# EAGLE design pico (EAGLE 6.4)
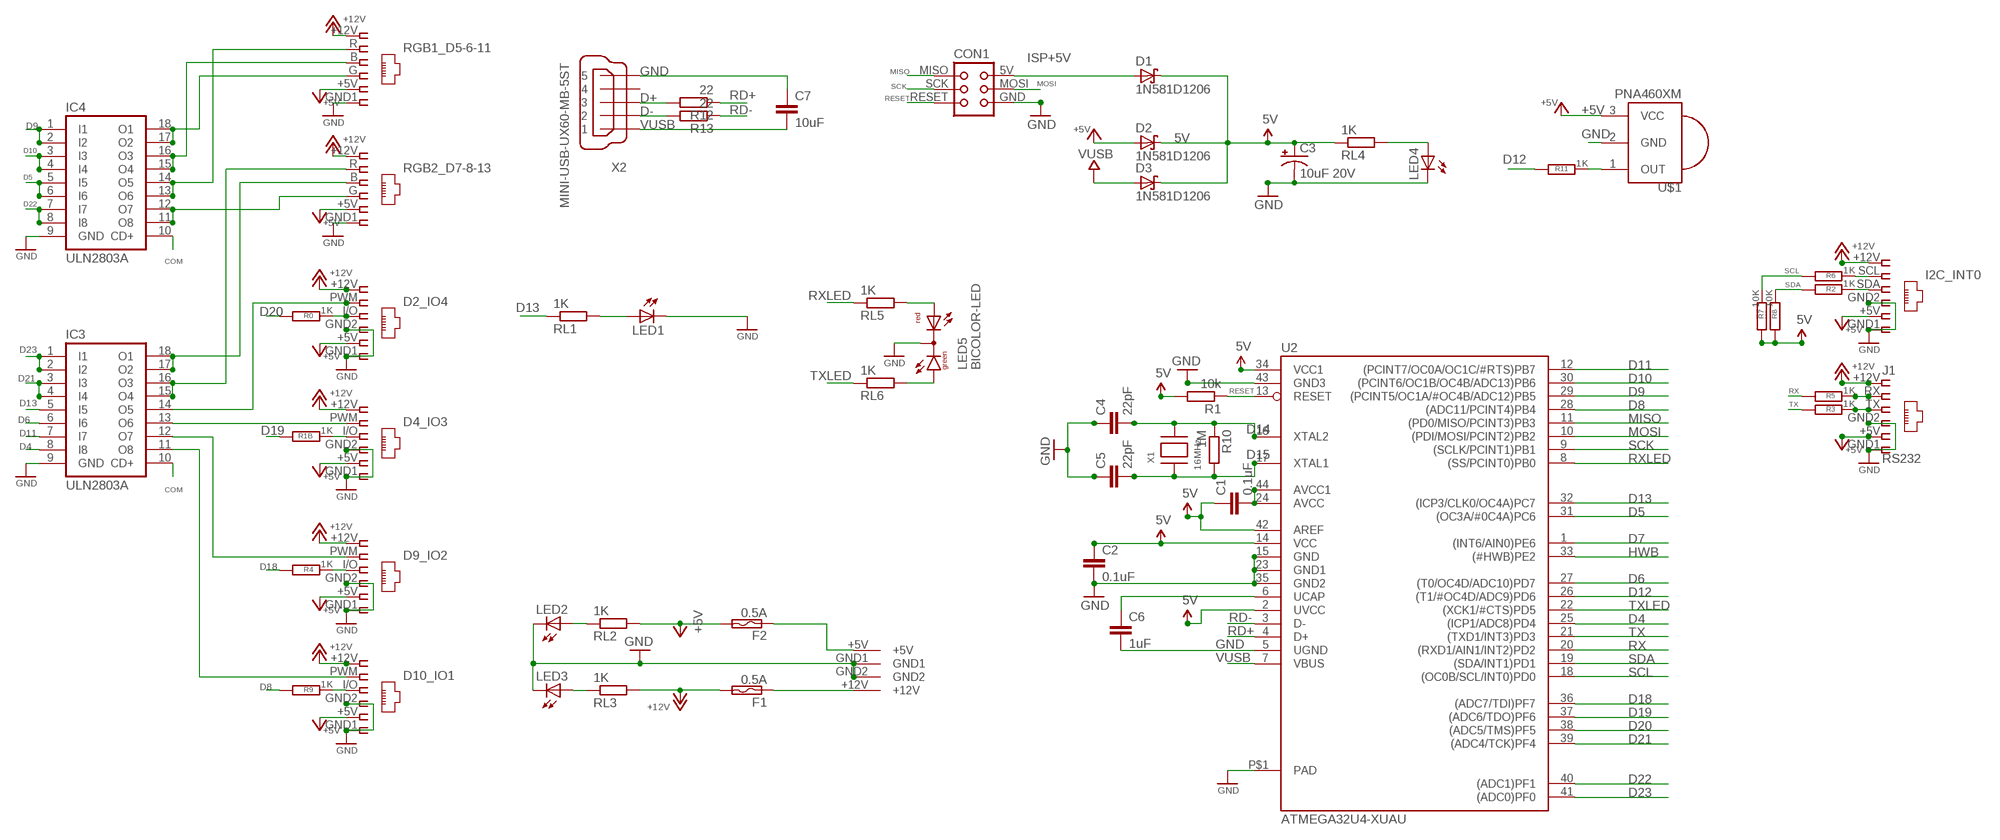
[diagram p0: schematic, sheet 1]

## Parts
C1  0.1uF  C-EUC1206  [C1206]
C2  0.1uF  C-EUC1206  [C1206]
C3  10uF 20V  CAP_POL1206-KIT  [EIA3216-KIT]
C4  22pF  C-EUC1206  [C1206]
C5  22pF  C-EUC1206  [C1206]
C6  1uF  C-EUC1206  [C1206]
C7  10uF  C-EUC1206  [C1206]
CON1  TINYISPT  [TC2030-MCP-NL]
D1  1N581D1206  [LED-1206]
D2  1N581D1206  [LED-1206]
D2_IO4  IO4  RJ12STRAIGHT  [RJ12-STRAIGHT]
D3  1N581D1206  [LED-1206]
D4_IO3  IO3  RJ12STRAIGHT  [RJ12-STRAIGHT]
D9_IO2  IO2  RJ12STRAIGHT  [RJ12-STRAIGHT]
D10_IO1  IO1  RJ12STRAIGHT  [RJ12-STRAIGHT]
F1  0.5A  POLYSWITCHSMD1812  [C1812]
F2  0.5A  POLYSWITCHSMD1812  [C1812]
I2C_INT0  I2C  RJ12STRAIGHT-I2C  [RJ12-STRAIGHT-I2C]
IC3  ULN2803A  [SO18W]
IC4  ULN2803A  [SO18W]
J1  RS232  RJ12STRAIGHT-RS232-SERVER  [RJ12-STRAIGHT-RS232]
LED1  LED3MM  [LED3MM]
LED2  5V  LED3MM  [LED3MM]
LED3  12V  LED3MM  [LED3MM]
LED4  5V uC  LED3MM  [LED3MM]
LED5  BICOLOR-LED  [BICOLOR-3MM]
R0  1K  R-EU_M1206  [M1206]
R1  10k  R-EU_M1206  [M1206]
R1B  1K  R-EU_M1206  [M1206]
R2  1K  R-EU_M1206  [M1206]
R3  1K  R-EU_M1206  [M1206]
R4  1K  R-EU_M1206  [M1206]
R5  1K  R-EU_M1206  [M1206]
R6  1K  R-EU_M1206  [M1206]
R7  10K  R-EU_M1206  [M1206]
R8  10K  R-EU_M1206  [M1206]
R9  1K  R-EU_M1206  [M1206]
R10  1M  R-EU_M1206  [M1206]
R11  1K  R-EU_M1206  [M1206]
R12  22  R-EU_M1206  [M1206]
R13  22  R-EU_M1206  [M1206]
RGB1_D5-6-11  RGB1  RJ12STRAIGHT-RGB  [RJ12-STRAIGHT-RGB]
RGB2_D7-8-13  RGB2  RJ12STRAIGHT-RGB  [RJ12-STRAIGHT-RGB]
RL1  1K  R-EU_M1206  [M1206]
RL2  1K  R-EU_M1206  [M1206]
RL3  1K  R-EU_M1206  [M1206]
RL4  1K  R-EU_M1206  [M1206]
RL5  1K  R-EU_M1206  [M1206]
RL6  1K  R-EU_M1206  [M1206]
U2  ATMEGA32U4-XUAU  [TQFP44-PAD]
U$1  PNA460XM  [PNA460XM]
U$2  KPJX-4S-S  [KPJX-4S-S]
X1  16MHz  XTALNX6035  [NX6035]
X2  MINI-USB-UX60-MB-5ST  [UX60-MB-5ST]

## Nets
5V: C1.1 C2.1 C3.A(+) D1.C D2.C D3.C R1.2 R7.2 R8.2 RL4.1 U2.2(UVCC) U2.14(VCC) U2.34(VCC1) U2.42(AREF)
+5V: D2.A D2_IO4.+5V D4_IO3.+5V D9_IO2.+5V D10_IO1.+5V F2.2 I2C_INT0.+5V J1.+5V RGB1_D5-6-11.+5V RGB2_D7-8-13.+5V RL2.2 U$1.3(VCC)
+12V: D2_IO4.+12V D4_IO3.+12V D9_IO2.+12V D10_IO1.+12V F1.2 I2C_INT0.+12V J1.+12V RGB1_D5-6-11.+12V RGB2_D7-8-13.+12V RL3.2
COM: IC3.10(CD+) IC4.10(CD+)
D2B: D9_IO2.I/O R4.1
D2B1: D10_IO1.I/O R9.1
D2B4: I2C_INT0.SDA R2.1
D2B5: J1.TX R3.1
D2B6: D2_IO4.I/O R0.1
D2B7: D4_IO3.I/O R1B.1
D4 [fine]: IC3.8(I8) U2.25((ICP1/ADC8)PD4)
D5 [fine]: IC4.5(I5) IC4.6(I6) U2.31((OC3A/#0C4A)PC6)
D6 [fine]: IC3.6(I6) U2.27((T0/OC4D/ADC10)PD7)
D7: U2.1((INT6/AIN0)PE6)
D8 [fine]: R9.2 U2.28((ADC11/PCINT4)PB4)
D9 [fine]: IC4.1(I1) IC4.2(I2) U2.29((PCINT5/OC1A/#OC4B/ADC12)PB5)
D10 [fine]: IC4.3(I3) IC4.4(I4) U2.30((PCINT6/OC1B/OC4B/ADC13)PB6)
D11 [fine]: IC3.7(I7) U2.12((PCINT7/OC0A/OC1C/#RTS)PB7)
D12: R11.2 U2.26((T1/#OC4D/ADC9)PD6)
D13 [fine]: IC3.5(I5) RL1.1 U2.32((ICP3/CLK0/OC4A)PC7)
D14 [fine]: C4.2 R10.1 U2.16(XTAL2) X1.P$2
D15 [fine]: C5.2 R10.2 U2.17(XTAL1) X1.P$1
D18 [fine]: R4.2 U2.36((ADC7/TDI)PF7)
D19 [fine]: R1B.2 U2.37((ADC6/TDO)PF6)
D20 [fine]: R0.2 U2.38((ADC5/TMS)PF5)
D21 [fine]: IC3.3(I3) IC3.4(I4) U2.39((ADC4/TCK)PF4)
D22 [fine]: IC4.7(I7) IC4.8(I8) U2.40((ADC1)PF1)
D23 [fine]: IC3.1(I1) IC3.2(I2) U2.41((ADC0)PF0)
D+: R12.2 X2.3
D-: R13.2 X2.2
GND: C2.2 C3.C(-) C4.1 C5.1 C6.2 C7.1 CON1.GND D2_IO4.GND1 D2_IO4.GND2 D4_IO3.GND1 D4_IO3.GND2 D9_IO2.GND1 D9_IO2.GND2 D10_IO1.GND1 D10_IO1.GND2 I2C_INT0.GND1 I2C_INT0.GND2 IC3.9(GND) IC4.9(GND) J1.GND1 J1.GND2 LED1.K(C) LED2.K(C) LED3.K(C) LED4.K(C) LED5.2(C) RGB1_D5-6-11.GND1 RGB2_D7-8-13.GND1 U2.5(UGND) U2.15(GND) U2.23(GND1) U2.35(GND2) U2.43(GND3) U2.P$1(PAD) U$1.2(GND) U$2.GND1 U$2.GND2 X2.5
HWB: U2.33((#HWB)PE2)
ISP+5V: CON1.5V(VCC) D1.A
MISO [fine]: CON1.MISO U2.11((PD0/MISO/PCINT3)PB3)
MOSI [fine]: CON1.MOSI U2.10((PDI/MOSI/PCINT2)PB2)
N$1 [PWM]: IC4.17(O2) IC4.18(O1) RGB1_D5-6-11.G
N$2 [PWM]: D4_IO3.PWM IC3.13(O6)
N$3: LED1.A RL1.2
N$4: C6.1 U2.6(UCAP)
N$6: F2.1 U$2.+5V
N$7: LED4.A RL4.2
N$8: F1.1 U$2.+12V
N$9: R11.1 U$1.1(OUT)
N$10: C1.2 U2.24(AVCC) U2.44(AVCC1)
N$11: LED5.3(AR) RL5.2
N$12: LED5.1(AG) RL6.2
N$13 [PWM]: IC3.15(O4) IC3.16(O3) RGB2_D7-8-13.R
N$22 [PWM]: D9_IO2.PWM IC3.12(O7)
N$48 [PWM]: IC3.17(O2) IC3.18(O1) RGB2_D7-8-13.B
N$50 [PWM]: IC4.15(O4) IC4.16(O3) RGB1_D5-6-11.B
N$51 [PWM]: D10_IO1.PWM IC3.11(O8)
N$57 [PWM]: IC4.11(O8) IC4.12(O7) RGB2_D7-8-13.G
N$60 [PWM]: D2_IO4.PWM IC3.14(O5)
N$68 [PWM]: IC4.13(O6) IC4.14(O5) RGB1_D5-6-11.R
N$70: J1.RX R5.1
N$71: I2C_INT0.SCL R6.1
N$75: LED3.A RL3.1
N$76: LED2.A RL2.1
RD+ [fine]: R12.1 U2.4(D+)
RD- [fine]: R13.1 U2.3(D-)
RESET [fine]: CON1.RESET R1.1 U2.13(RESET)
RX [fine]: R5.2 U2.20((RXD1/AIN1/INT2)PD2)
RXLED [fine]: RL5.1 U2.8((SS/PCINT0)PB0)
SCK [fine]: CON1.SCK U2.9((SCLK/PCINT1)PB1)
SCL [fine]: R6.2 R7.1 U2.18((OC0B/SCL/INT0)PD0)
SDA [fine]: R2.2 R8.1 U2.19((SDA/INT1)PD1)
TX [fine]: R3.2 U2.21((TXD1/INT3)PD3)
TXLED [fine]: RL6.1 U2.22((XCK1/#CTS)PD5)
VUSB: C7.2 D3.A U2.7(VBUS) X2.1
Unconnected: X2.4

## Library data of the parts
C1 C2 C4-C7 = resistor:C-EU: CAPACITOR, European symbol
C3 = SparkFun:CAP_POL: Capacitor Polarized These are standard SMD and PTH capacitors. Normally 10uF, 47uF, and 100uF in electrolytic and tantalum varieties. Always verify the external diameter of the through hole cap, it varies with capacity, voltage, and manufacturer. The EIA devices should be standard.
CON1 = lpatiny:TINYISP: CONNECTOR
D1-D3 = lpatiny:1N581*: 1.0A SCHOTTKY BARRIER RECTIFIER Source: http://www.diodes.com/datasheets/ds23001.pdf
D2_IO4 D4_IO3 D9_IO2 D10_IO1 I2C_INT0 J1 RGB1_D5-6-11 RGB2_D7-8-13 = lpatiny:RJ12: CORCOM Modular RJ Jacks No Shield Source: www.tycoelectronics.com .. ENG_DS_1654001_1099_RJ_L_0507.pdf
F1 F2 = lpatiny:POLYSWITCH: PolySwitch (TM) Resettable Device Source: Data sheet <http://www.farnell.com/datasheets/13482.pdf>
IC3 IC4 = lpatiny:ULN2803A: DRIVER ARRAY
LED1-LED4 = lpatiny:LED3MM
LED5 = lpatiny:BICOLOR-LED: T-1(3mm) BI-COLOR INDICATOR LAMP Source: Kingbright .. 2_colour_led_.pdf
R0 R1 R1B R2-R13 RL1-RL6 = resistor:R-EU_: RESISTOR, European symbol
U2 = SmartPrj:ATMEGA32U4-XU
U$1 = adafruit:PNA460XM: IR 38KHz receiver PNA4602 and related receivers http://www.ladyada.net/library/pcb/eaglelibrary.html
U$2 = lpatiny:KPJX-4S-S
X1 = lpatiny:XTAL: Low cost SMT crystals, no capacitors included http://www.ladyada.net/library/eagle
X2 = con-hirose:MINI-USB-: MINI USB Connector Source: http://www.hirose.co.jp/cataloge_hp/e24000019.pdf; OC_FARNELL: unknown; OC_NEWARK: unknown

## Net classes
0 default: width 0.457 mm
1 power: width 0.457 mm
2 highpower: width 0.914 mm
3 fine: width 0.457 mm
4 PWM: width 0.61 mm

## Board
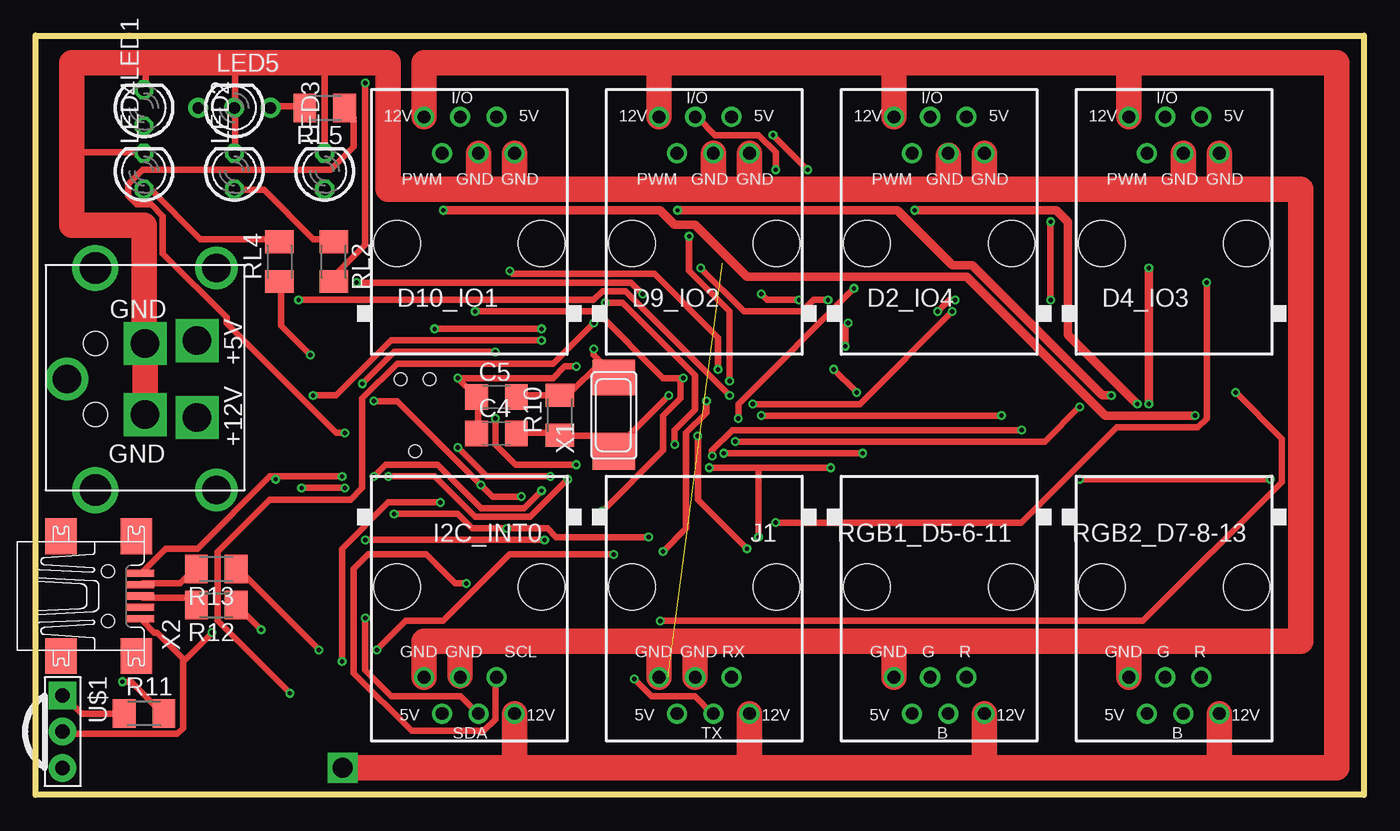
[diagram p1: board, top side]
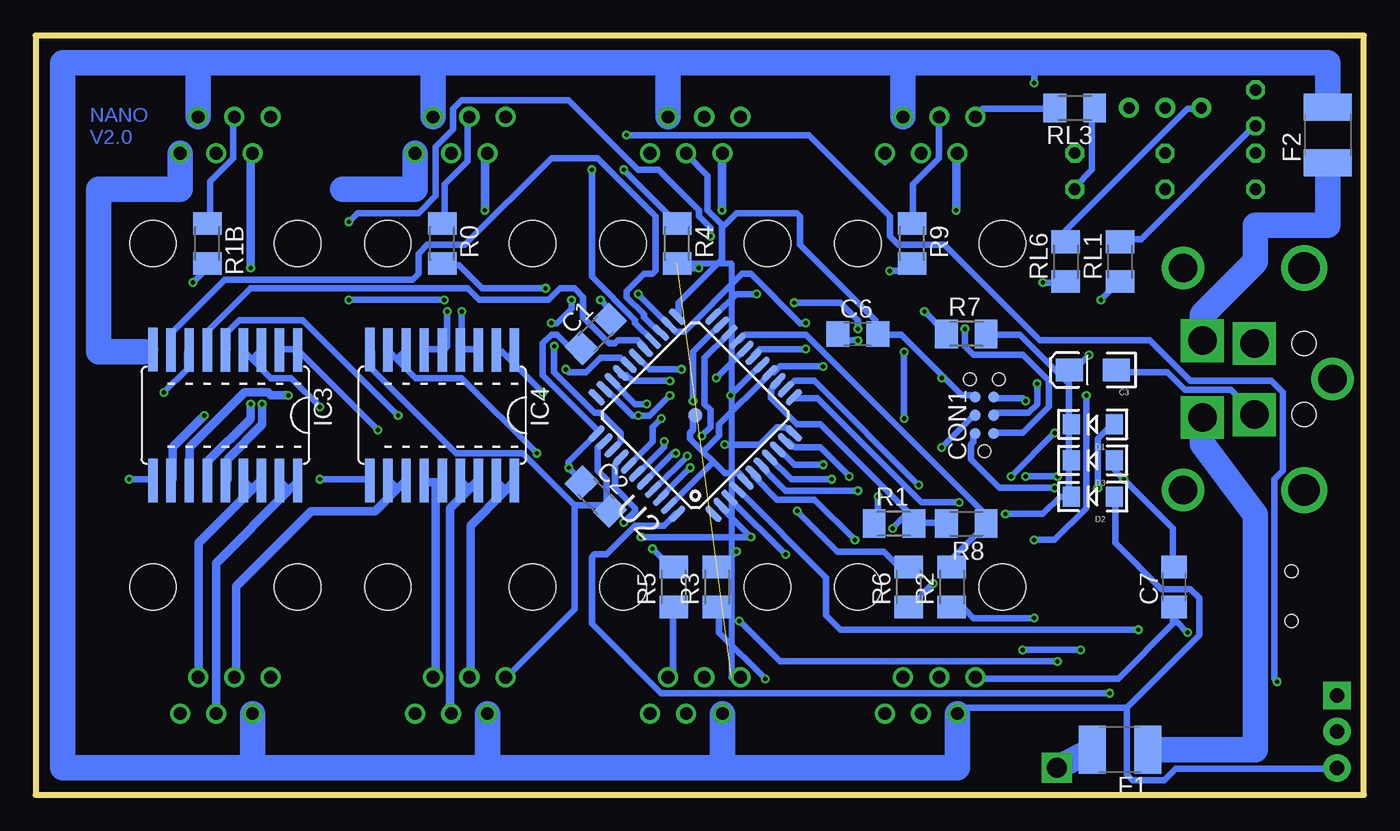
[diagram p2: board, bottom side, seen from below]

Size 93.34 x 53.34 mm. Coordinates in mm from the lower left corner, seen from the top.
Outline: 0,0 0,53.34 93.34,53.34 93.34,0 0,0
Copper layers (1*16): Top 0.035mm / dielectric 1.5mm / Bottom 0.035mm
Design rules "default": minimum track width 6mil, minimum drill 12mil, track to track 6mil, track to pad 6mil, pad to pad 6mil, via to via 6mil, smd to smd 0mil, copper to edge 10mil, drill to drill 10mil, minimum pad ring 10mil, minimum via ring 6mil, stop-mask expansion 2mil, vias tented up to drill 100mil, thermal gap 10mil
vRestrict: area 73.7,28.6 to 86.4,33.7; area 73.7,19.7 to 86.4,24.8; area 58.4,28.6 to 71.1,33.7; area 58.4,19.7 to 71.1,24.8; area 44.5,15.9 to 57.1,28.5; area 36.9,24.8 to 49.5,37.4; area 44.5,24.8 to 57.1,37.4; area 36.9,15.9 to 49.5,28.5; area 24.1,22.9 to 29.2,30.5

### Footprints (pad centres in the part's own frame; a part is rotated, then mirrored left to right if it is on the bottom)
C1206 = smd 1.6 x 1.8: 1 -1.4,0; 2 1.4,0
EIA3216-KIT = smd 1.9 x 1.6: A 1.65,0; C -1.65,0
TC2030-MCP-NL = smd 0.787 x 0.787: 5V 1.27,0.635; GND 3.81,0.635; MISO 1.27,-0.635; MOSI 2.54,0.635; RESET 3.81,-0.635; SCK 2.54,-0.635 | hole 0.889: 0,0; 5.08,-1.016; 5.08,1.016
LED-1206 = smd 1.2 x 1.4: A -1.5,0; C 1.5,0
RJ12-STRAIGHT = drill 0.9 pad 1.4: +5V 1.905,8.89; +12V -3.175,8.89; GND1 3.175,6.35; GND2 0.635,6.35; I/O -0.635,8.89; PWM -1.905,6.35 | hole 3.251: -5.08,0; 5.08,0
C1812 = smd 1.9 x 3.4: 1 -1.95,0; 2 1.95,0
RJ12-STRAIGHT-I2C = drill 0.9 pad 1.4: +5V 1.905,8.89; +12V -3.175,8.89; GND1 3.175,6.35; GND2 0.635,6.35; SCL -1.905,6.35; SDA -0.635,8.89 | hole 3.251: -5.08,0; 5.08,0
SO18W = smd 0.66 x 3.048: 1 -5.08,-4.585; 2 -3.81,-4.585; 3 -2.54,-4.585; 4 -1.27,-4.585; 5 0,-4.585; 6 1.27,-4.585; 7 2.54,-4.585; 8 3.81,-4.585; 9 5.08,-4.623; 10 5.08,4.585; 11 3.81,4.585; 12 2.54,4.585; 13 1.27,4.585; 14 0,4.585; 15 -1.27,4.585; 16 -2.54,4.585; 17 -3.81,4.585; 18 -5.08,4.585
RJ12-STRAIGHT-RS232 = drill 0.9 pad 1.4: +5V 1.905,8.89; +12V -3.175,8.89; GND1 3.175,6.35; GND2 0.635,6.35; RX -1.905,6.35; TX -0.635,8.89 | hole 3.251: -5.08,0; 5.08,0
LED3MM = drill 0.813 octagon: A -1.27,0; K 1.27,0
BICOLOR-3MM = drill 0.8 pad 1.4: 1 -2.54,0; 2 0,0; 3 2.54,0
M1206 = smd 1.6 x 2: 1 -1.4,0; 2 1.4,0
RJ12-STRAIGHT-RGB = drill 0.9 pad 1.4: +5V 1.905,8.89; +12V -3.175,8.89; B -0.635,8.89; G 0.635,6.35; GND1 3.175,6.35; R -1.905,6.35 | hole 3.251: -5.08,0; 5.08,0
TQFP44-PAD = smd 1.4 x 0.45: 1 -5.8,4; 2 -5.8,3.2; 3 -5.8,2.4; 4 -5.8,1.6; 5 -5.8,0.8; 6 -5.8,0; 7 -5.8,-0.8; 8 -5.8,-1.6; 9 -5.8,-2.4; 10 -5.8,-3.2; 11 -5.8,-4; 23 5.8,-4; 24 5.8,-3.2; 25 5.8,-2.4; 26 5.8,-1.6; 27 5.8,-0.8; 28 5.8,0; 29 5.8,0.8; 30 5.8,1.6; 31 5.8,2.4; 32 5.8,3.2; 33 5.8,4 | smd 0.45 x 1.4: 12 -4,-5.8; 13 -3.2,-5.8; 14 -2.4,-5.8; 15 -1.6,-5.8; 16 -0.8,-5.8; 17 0,-5.8; 18 0.8,-5.8; 19 1.6,-5.8; 20 2.4,-5.8; 21 3.2,-5.8; 22 4,-5.8; 34 4,5.8; 35 3.2,5.8; 36 2.4,5.8; 37 1.6,5.8; 38 0.8,5.8; 39 0,5.8; 40 -0.8,5.8; 41 -1.6,5.8; 42 -2.4,5.8; 43 -3.2,5.8; 44 -4,5.8 | smd 1 x 1: P$1 0,0
PNA460XM = drill 1.016 pad 1.93 square: 1 -2.54,0 | drill 1.016 pad 1.93: 2 0,0; 3 2.54,0
KPJX-4S-S = drill 2 square: +5V 2.7,1.35; +12V -2.7,1.35; GND1 -2.5,5; GND2 2.5,5 | drill 2: P$1 -7.8,0; P$2 7.8,0; P$11 0,10.5 | drill 2.2: P$3 -7.8,8.5; P$4 7.8,8.5 | hole 1.7: -2.5,8.5; 2.5,8.5
NX6035 = smd 2.5 x 3: P$1 2.665,0; P$2 -2.565,0
UX60-MB-5ST = smd 2 x 0.5: 1 2.25,1.6; 2 2.25,0.8; 3 2.25,0; 4 2.25,-0.8; 5 2.25,-1.6 | smd 2.2 x 2.5: M1 -3.3,-4.2; M2 -3.3,4.2; M3 2,4.2; M4 2,-4.2 | hole 0.9: 0,-1.75; 0,1.75

### Placement (x,y rotation side)
C1  53.98,32.38 45 bottom
C2  53.98,20.96 315 bottom
C3  19.05,29.85 180 bottom
C4  32.38,25.4 0 top
C5  32.38,27.94 0 top
C6  35.56,32.38 0 bottom
C7  13.34,14.61 90 bottom
CON1  26.67,24.13 90 bottom
D1  19.05,26.04 180 bottom
D2  19.05,20.96 180 bottom
D2_IO4  63.5,38.73 0 top
D3  19.05,23.5 180 bottom
D4_IO3  80.01,38.73 0 top
D9_IO2  46.99,38.73 0 top
D10_IO1  30.48,38.73 0 top
F1  17.14,3.17 180 bottom
F2  2.54,46.35 90 bottom
I2C_INT0  30.48,14.61 180 top
IC3  80.01,26.67 180 bottom
IC4  64.77,26.67 180 bottom
J1  46.99,14.61 180 top
LED1  7.62,48.26 90 top
LED2  13.97,43.81 90 top
LED3  20.32,43.81 90 top
LED4  7.62,43.81 90 top
LED5  13.97,48.26 0 top
R0  64.77,38.73 270 bottom
R1  33.02,19.05 0 bottom
R1B  81.28,38.73 270 bottom
R2  28.96,14.61 90 bottom
R3  45.47,14.61 90 bottom
R4  48.26,38.73 270 bottom
R5  48.51,14.61 90 bottom
R6  32,14.61 90 bottom
R7  27.94,32.38 0 bottom
R8  27.94,19.05 180 bottom
R9  31.75,38.73 270 bottom
R10  36.83,26.67 90 top
R11  7.62,5.71 0 top
R12  12.7,13.33 180 top
R13  12.7,15.88 180 top
RGB1_D5-6-11  63.5,14.61 180 top
RGB2_D7-8-13  80.01,14.61 180 top
RL1  17.14,37.46 90 bottom
RL2  20.95,37.46 270 top
RL3  20.32,48.26 180 bottom
RL4  17.14,37.46 90 top
RL5  20.32,48.26 180 top
RL6  20.95,37.46 90 bottom
U2  46.99,26.67 135 bottom
U$1  1.91,4.45 270 top
U$2  12.7,29.21 90 top
X1  40.64,26.67 90 top
X2  5.08,13.97 0 top

### Tracks (layer width: path | path; a pad name or v marks a point on that pad's centre or on a via)
5V  (via drill 0.3)
  Top 0.457: v19.3,30.91 17.27,32.94 17.27,35.99 RL4.1 | v55.88,22.99 50.8,22.99 | 50.8,22.99 v47.35,22.99 | v43.08,18.11 36.58,18.11 35.97,18.72 v33.12,18.72 30.68,18.72 29.67,19.74 v25.2,19.74 | v50.8,18.11 50.8,22.99
  Bottom 0.457: C3.A 20.73,29.69 20.73,26.24 D1.C 20.73,26.04 20.73,23.6 D3.C 20.73,23.39 20.73,20.96 D2.C 21.34,20.96 22.55,19.74 v25.2,19.74 | v19.3,30.91 20.52,29.69 C3.A | R7.2 26.42,32.33 24.18,32.33 20.93,29.08 C3.A | v47.35,22.99 49.38,20.96 U2.42 | C2.1 54.86,21.97 v55.88,22.99 55.88,23.39 54.05,25.22 U2.34 53.85,25.63 57.71,29.49 57.71,31.73 57.1,32.33 56.69,32.33 55.88,31.52 55.07,31.52 C1.1 | U2.14 41.25,28.88 41.66,28.47 41.66,27.86 39.83,26.04 38.2,26.04 31.7,19.53 31.7,19.13 R1.2 | v33.12,18.72 32.11,19.74 R1.2 | U2.2 45.11,20.14 v43.08,18.11 v50.8,18.11 | R8.2 29.46,19.13 31.5,19.13 R1.2
+5V  (via drill 0.3)
  Top 0.457: v23.16,50.01 23.16,38.63 21.13,36.6 21.13,36.2 RL2.2
  Bottom 0.457: 16.66,6.12 11.58,11.2 11.58,13.84 12.19,14.45 14.22,14.45 17.48,17.7 17.48,20.96 D2.A | 16.66,6.12 27.84,6.12 I2C_INT0.+5V | v23.16,50.01 23.16,51.43 | 16.66,6.12 16.66,1.45 16.26,1.04 14.02,1.04 13.21,1.85 2.03,1.85 U$1.3
  Bottom 1.778: 32.38,51.43 23.16,51.43 2.54,51.43 F2.2 | 32.38,51.43 48.9,51.43 | 48.9,51.43 65.41,51.43 | 65.41,51.43 81.92,51.43 | 81.92,51.43 91.44,51.43 91.44,1.91 78.11,1.91 | 45.09,1.91 28.57,1.91 I2C_INT0.+5V | 45.09,1.91 61.59,1.91 | 78.11,1.91 61.59,1.91 | 61.59,1.91 RGB1_D5-6-11.+5V | RGB2_D7-8-13.+5V 78.11,1.91 | J1.+5V 45.09,1.91 | D4_IO3.+5V 81.92,51.43 | D2_IO4.+5V 65.41,51.43 | D9_IO2.+5V 48.9,51.43 | D10_IO1.+5V 32.38,51.43
+12V  (via drill 1.4)
  Top 1.778: v21.59,1.91 33.66,1.91 | 66.67,1.91 83.19,1.91 | 66.67,1.91 50.16,1.91 | 50.16,1.91 33.66,1.91 | 83.19,1.91 91.44,1.91 91.44,51.43 76.83,51.43 | 76.83,51.43 60.33,51.43 | 60.33,51.43 43.81,51.43 | 43.81,51.43 27.3,51.43 D10_IO1.+12V | D9_IO2.+12V 43.81,51.43 | RGB1_D5-6-11.+12V 66.67,1.91 | RGB2_D7-8-13.+12V 83.19,1.91 | J1.+12V 50.16,1.91 | I2C_INT0.+12V 33.66,1.91 | D4_IO3.+12V 76.83,51.43 | D2_IO4.+12V 60.33,51.43
  Bottom 0.457: RL3.2 21.74,48.18 26.82,48.18 27.23,47.78 D10_IO1.+12V
  Bottom 1.778: F1.2 v21.59,1.91
COM  (via drill 0.3)
  Top 0.457: v86.77,22.17 v73.36,22.17
  Bottom 0.457: v86.77,22.17 85.14,22.17 IC3.10 | v73.36,22.17 69.9,22.17 IC4.10
D2B  (via drill 0.3)
  Top 0.457: v52.02,43.92 52.02,45.14 50.8,46.35 47.75,46.35 46.53,47.57 D9_IO2.I/O
  Bottom 0.457: v52.02,43.92 48.36,40.26 R4.1
D2B1
  Bottom 0.457: R9.1 31.7,40.26 31.7,42.9 29.87,44.73 29.87,47.57 D10_IO1.I/O
D2B4  (via drill 0.3)
  Top 0.457: v23.16,12.42 23.16,8.76 24.99,6.93 29.87,6.93 31.09,5.71 I2C_INT0.SDA
  Bottom 0.457: v23.16,12.42 27.43,12.42 28.04,13.03 28.85,13.03 R2.1
D2B5  (via drill 0.3)
  Top 0.457: v42.06,8.15 43.28,6.93 46.33,6.93 47.55,5.71 J1.TX
  Bottom 0.457: v42.06,8.15 45.31,11.4 45.31,13.03 R3.1
D2B6
  Bottom 0.457: R0.1 64.62,40.26 64.62,42.9 62.99,44.53 62.99,47.57 D2_IO4.I/O
D2B7
  Bottom 0.457: 81.18,40.26 R1B.1 81.08,40.46 81.08,43.1 79.45,44.73 79.45,47.57 D4_IO3.I/O
D4
  Bottom 0.457: 83.72,32.54 83.72,31.32 IC3.8 83.72,32.54 | 83.72,32.54 80.06,36.2 66.85,36.2 66.45,36.6 66.45,38.02 65.84,38.63 63.2,38.63 57.1,44.73 53.85,44.73 49.78,40.66 49.78,36.8 49.99,36.6 50.6,36.6 51.82,35.38 51.82,34.98 50.6,33.76 50.6,33.55 49.58,32.54 U2.25
D5  (via drill 0.3)
  Top 0.457: v50.39,27.46 57.91,27.46 v64.41,33.96
  Bottom 0.457: v50.39,27.46 51.21,27.46 52.63,28.88 U2.31 | v64.41,33.96 64.41,31.52 64.62,31.32 IC4.5 64.82,31.32 66.04,31.32 IC4.6
D6
  Bottom 0.457: IC3.6 81.28,32.54 78.23,35.59 62.99,35.59 62.18,34.77 57.3,34.77 56.49,35.59 55.47,35.59 54.86,34.98 54.86,33.55 53.03,31.73 52.63,31.73 52.43,31.93 51,31.93 50.6,31.52 U2.27
D8  (via drill 0.3)
  Top 0.457: v47.95,29.9 47.95,32.13 43.48,36.6 33.53,36.6 v33.33,36.8
  Bottom 0.457: v47.95,29.9 50.19,29.9 51,30.71 U2.28 | v33.33,36.8 32.31,36.8 31.9,37.21 R9.2
D9  (via drill 0.3)
  Top 0.457: v57.71,28.27 v56.08,29.9
  Bottom 0.457: v56.08,29.9 55.88,29.69 54.66,29.69 53.65,30.71 52.22,30.71 51.82,30.3 U2.29 | 60.15,30.71 60.55,31.12 60.96,31.12 IC4.2 | 60.15,30.71 v57.71,28.27 | 60.15,30.71 59.74,31.12 IC4.1
D10  (via drill 0.3)
  Top 0.457: v48.77,29.08 48.77,33.96 45.92,36.8 v45.92,39.24 | v71.32,34.77 v71.32,40.26 | v64.62,34.77 64.21,34.77 v63.4,33.96
  Bottom 0.457: v48.77,29.08 51.41,29.08 51.82,29.49 52.22,29.49 U2.30 | v45.92,39.24 45.92,39.85 46.74,40.66 46.74,41.07 49.58,43.92 51,43.92 55.88,48.79 63.4,48.79 64.01,48.18 64.01,46.76 65.23,45.54 65.23,42.09 66.45,40.87 70.71,40.87 v71.32,40.26 | v64.62,34.77 v71.32,34.77 | v63.4,33.96 63.4,31.32 IC4.4 63.2,31.32 62.38,31.32 IC4.3
D11  (via drill 0.3)
  Top 0.457: v28.45,20.55 24.79,20.55 21.54,17.3 v21.54,9.37 | v43.89,12.22 77.83,12.22 87.58,21.97 87.58,25.02 v84.33,28.27
  Bottom 0.457: v28.45,20.55 31.09,20.55 38.41,27.86 40.03,27.86 U2.12 | v21.54,9.37 41.05,9.37 v43.89,12.22 | v84.33,28.27 82.7,29.9 82.7,31.12 IC3.7
D12  (via drill 0.3)
  Top 0.457: v51.82,46.35 v54.25,43.92 | v6.1,7.95 6.71,7.95 8.94,5.71 R11.2
  Bottom 0.457: v54.25,43.92 54.25,36.4 51.21,33.35 51.21,33.15 49.99,31.93 U2.26 | v51.82,46.35 39.01,46.35 33.33,40.66 33.33,39.24 32.72,38.63 29.46,38.63 22.76,31.93 15.04,31.93 12.19,29.08 6.5,29.08 5.69,28.27 5.69,22.78 6.3,22.17 6.3,8.15 v6.1,7.95
D13  (via drill 0.3)
  Top 0.457: v67.87,26.65 v51,26.65 | v18.49,34.77 39.22,34.77 39.83,35.38 41.45,35.38 v48.77,28.07
  Bottom 0.457: v67.87,26.65 74.57,33.35 79.05,33.35 79.86,32.54 79.86,31.32 IC3.5 | U2.32 53.24,28.47 51.41,26.65 v51,26.65 50.19,26.65 v48.77,28.07 | v18.49,34.77 17.27,35.99 RL1.1
D14  (via drill 0.3)
  Top 0.457: C4.2 33.93,25.43 36.78,25.43 R10.1 36.98,25.22 41.45,25.22 X1.P$2 40.64,24.21 v44.5,28.07
  Bottom 0.457: v44.5,28.07 42.47,30.1 U2.16
D15  (via drill 0.3)
  Top 0.457: C5.2 33.93,28.07 36.78,28.07 R10.2 36.98,28.27 37.59,28.27 39.62,30.3 X1.P$1 40.64,29.49 39.22,30.91 v39.22,31.32
  Bottom 0.457: v39.22,31.32 42.47,31.32 42.88,30.91 U2.17
D18  (via drill 0.3)  (1 unrouted)
  Top 0.457: v56.9,31.52 56.9,32.94 v57.1,33.15 | v55.68,34.77 54.66,34.77 53.85,33.96 49.78,33.96 v46.74,37.01
  Bottom 0.406: R4.2 44.45,37.34 44.45,8.26
  Bottom 0.457: v56.9,31.52 56.9,29.69 54.05,26.85 53.65,26.85 52.22,25.43 52.22,24.82 52.63,24.41 U2.36 | v57.1,33.15 56.69,33.15 55.68,34.16 v55.68,34.77 | v46.74,37.01 47.95,37.01 48.16,37.21 R4.2
D19  (via drill 0.3)
  Top 0.457: v52.02,19.13 69.29,19.13 76,25.83 81.69,25.83 82.3,26.44 v82.3,35.99
  Bottom 0.457: v52.02,19.13 51.21,19.94 51.21,20.14 52.63,21.57 52.63,23.19 52.43,23.39 52.43,23.6 U2.37 | v82.3,35.99 81.28,37.01 R1B.2
D20  (via drill 0.3)
  Top 0.457: v49.38,26.44 49.38,27.46 v57.51,35.59
  Bottom 0.457: v49.38,26.44 49.99,25.83 49.99,24.82 51.61,23.19 U2.38 | v57.51,35.59 61.98,35.59 63.6,37.21 64.62,37.21 R0.2
D21  (via drill 0.3)
  Top 0.457: v49.17,24.82 70.92,24.82 v73.36,27.25
  Bottom 0.457: v49.17,24.82 49.17,24.41 51,22.58 U2.39 | v73.36,27.25 75.39,29.29 76.81,29.29 78.13,30.61 | 78.13,30.61 78.64,31.12 IC3.4 | 78.13,30.61 77.62,31.12 IC3.3
D22  (via drill 0.3)
  Top 0.457: v58.12,24 v48.36,24
  Bottom 0.457: v48.36,24 48.56,24 50.39,22.17 U2.40 | v58.12,24 63.4,29.29 66.65,29.29 67.97,30.61 | 67.97,30.61 68.48,31.12 IC4.8 | 67.97,30.61 67.46,31.12 IC4.7
D23  (via drill 0.3)
  Top 0.457: v47.55,23.8 47.55,24.21 48.97,25.63 v69.29,25.63
  Bottom 0.457: v47.55,23.8 49.78,21.57 U2.41 | v69.29,25.63 74.78,31.12 IC3.1 74.98,31.32 76.2,31.32 IC3.2
D+
  Top 0.457: X2.3 7.52,13.84 10.77,13.84 11.18,13.44 R12.2
D-
  Top 0.457: X2.2 7.52,14.86 10.16,14.86 11.18,15.88 R13.2
GND  (via drill 0.3)
  Top 0.457: 29.82,8.36 I2C_INT0.GND2 | 59.54,10.39 60.33,10.79 | D2_IO4.GND2 64.21,45.14 64.14,44.93 | 26.62,10.59 27.3,10.59 | 8.13,26.04 U$2.GND1 | 10.36,9.58 8.53,11.4 8.33,11.4 7.52,12.22 X2.5 | 10.36,9.58 10.36,4.7 9.96,4.29 2.03,4.29 U$1.2 | C4.1 31.09,25.43 31.09,27.86 C5.1 30.89,28.07 v29.67,29.29 36.37,29.29 37.19,30.1 v38,30.1 | LED2.K 14.02,45.14 14.02,48.18 LED5.2 14.02,48.39 14.02,51.43 | 2.54,45.14 7.52,45.14 LED4.K | 7.72,51.43 7.72,49.61 LED1.K | 20.32,51.43 LED3.K | v12.39,11.4 10.57,9.58 10.36,9.58
  Top 1.27: U$2.GND2 7.62,31.71 | 29.82,8.36 29.84,8.36 | 64.11,44.93 64.14,44.93
  Top 1.778: U$2.GND1 U$2.GND2 | 7.62,31.71 7.62,40 2.54,40 2.54,45.14 2.54,51.43 7.72,51.43 14.02,51.43 20.32,51.43 24.77,51.43 24.77,42.54 31.11,42.54 | 31.11,42.54 33.66,42.54 | 33.66,42.54 47.62,42.54 | 47.62,42.54 50.16,42.54 | 50.16,42.54 64.14,42.54 | 64.14,42.54 66.67,42.54 | 66.67,42.54 80.64,42.54 | 80.64,42.54 83.19,42.54 | 83.19,42.54 88.9,42.54 88.9,10.79 76.83,10.79 | 29.84,10.79 27.3,10.79 27.3,10.59 I2C_INT0.GND1 | 29.84,10.79 43.81,10.79 | 46.35,10.79 43.81,10.79 | 46.35,10.79 60.33,10.79 | 76.83,10.79 60.33,10.79 | 60.33,10.79 RGB1_D5-6-11.GND1 | RGB2_D7-8-13.GND1 76.83,10.79 | J1.GND1 43.81,10.79 | J1.GND2 46.35,10.79 | D4_IO3.GND1 83.19,42.54 | D2_IO4.GND1 66.67,42.54 | D9_IO2.GND1 50.16,42.54 | D10_IO1.GND1 33.66,42.54 | 29.84,8.36 29.84,10.79 | D4_IO3.GND2 80.64,42.54 | 64.14,44.93 64.14,42.54 | D10_IO1.GND2 31.11,42.54 | D9_IO2.GND2 47.62,42.54
  Bottom 0.457: 33.66,44.45 33.83,44.93 D10_IO1.GND1 | 13.41,13.03 C7.1 13.41,12.83 13.41,12.22 | 27.23,8.36 I2C_INT0.GND1 27.23,8.15 17.27,8.15 13.41,12.01 13.41,12.22 | 69.9,31.32 IC4.9 69.7,31.12 69.7,29.9 63.8,24 59.13,24 55.47,20.35 | U2.35 53.44,24.82 53.85,24.41 53.85,22.78 53.24,22.17 53.24,20.35 53.03,20.14 C2.2 53.44,20.35 55.47,20.35 | 41.66,29.69 U2.15 | 45.72,23.39 44.91,22.58 43.89,22.58 43.48,22.17 U2.5 | 45.72,23.39 46.43,24.11 | 46.43,24.11 47.35,25.02 47.35,25.43 47.14,25.63 47.14,26.65 U2.P$1 | 46.43,24.11 45.31,25.22 45.31,26.04 41.86,29.49 U2.15 | 45.72,23.39 48.77,20.35 U2.43 | 29.57,29.39 32.51,32.33 34.14,32.33 C6.2 34.34,32.54 34.34,33.35 39.62,38.63 39.62,40.66 39.83,40.87 44.09,40.87 44.91,40.06 45.11,40.06 | 29.57,29.39 28.25,28.07 27.43,28.07 CON1.GND | v29.67,29.29 29.57,29.39 | 45.11,40.06 45.11,37.62 48.16,34.57 48.16,33.76 U2.23 | 45.11,40.06 46.13,41.07 46.13,43.51 47.55,44.93 D9_IO2.GND2 | C3.C 17.27,29.69 13.82,29.69 12.6,28.47 9.35,28.47 7.72,26.85 U$2.GND1 | v38,30.1 41.05,30.1 41.45,29.69 U2.15 | v12.39,11.4 13.21,12.22 13.41,12.22 | 55.47,20.35 55.47,13.03 60.15,8.36 RGB1_D5-6-11.GND1
  Bottom 0.762: IC3.9 85.72,31.29 85.72,31.12
  Bottom 1.778: 85.72,31.12 88.9,31.12 88.9,42.54 83.19,42.54 D4_IO3.GND1 | 71.75,42.54 66.67,42.54 D2_IO4.GND1
ISP+5V  (via drill 0.3)
  Top 0.457: v18.69,21.57 v21.74,21.57
  Bottom 0.457: v21.74,21.57 25.6,21.57 27.64,23.6 27.64,24.61 27.43,24.82 27.43,25.22 CON1.5V | v18.69,21.57 18.69,25.02 17.68,26.04 D1.A
MISO  (via drill 0.3)
  Top 0.457: v35.56,32.74 v28.04,32.74 | v40.03,34.57 41.25,34.57 46.33,29.49 46.33,27.05 44.91,25.63 v44.91,24.61
  Bottom 0.457: v28.04,32.74 28.04,31.52 27.43,30.91 23.98,30.91 22.15,29.08 22.15,27.25 23.98,25.43 26.01,25.43 CON1.MISO | v35.56,32.74 35.56,33.35 36.78,34.57 v40.03,34.57 | v44.91,24.61 42.47,24.61 41.25,25.83 40.64,25.83 40.23,25.43 U2.11
MOSI  (via drill 0.3)
  Top 0.457: v29.67,24.41 31.7,22.38 v36.17,22.38
  Bottom 0.457: v29.67,24.41 27.43,26.65 CON1.MOSI | v36.17,22.38 38.2,24.41 40.03,24.41 40.44,24.82 U2.10
N$1
  Bottom 0.61: 60.35,21.36 59.74,21.97 IC4.18 | 60.35,21.36 62.79,18.92 62.79,8.36 RGB1_D5-6-11.G | 60.35,21.36 60.96,21.97 IC4.17
N$2  (via drill 0.3)
  Top 0.61: v78.23,27.46 v78.23,37.01
  Bottom 0.61: v78.23,37.01 78.23,44.93 D4_IO3.PWM | v78.23,27.46 78.23,26.44 81.28,23.39 IC3.13
N$3
  Bottom 0.457: RL1.2 17.07,39.04 15.65,39.04 7.72,46.96 LED1.A
N$4  (via drill 0.3)
  Top 0.457: v23.16,17.91 v35.76,17.91 | v19.51,28.07 21.13,28.07 24.99,31.93 v35.56,31.93
  Bottom 0.457: v35.76,17.91 38.61,20.75 41.25,20.75 42.88,22.38 U2.6 | v23.16,17.91 21.74,17.91 19.51,20.14 v19.51,28.07 | v35.56,31.93 36.37,31.93 36.78,32.33 C6.1
N$6
  Bottom 0.457: 11.38,33.02 11.35,33.65 11.35,33.73
  Bottom 1.778: 11.35,33.73 7.62,37.46 7.62,40 2.54,40 F2.1 | U$2.+5V 11.35,33.65
N$7
  Top 0.457: RL4.2 17.07,39.04 11.58,39.04 8.13,42.49 7.72,42.49 LED4.A
N$8
  Bottom 1.778: U$2.+12V 11.35,24.69 7.62,19.69 7.62,3.17 F1.1
N$9
  Top 0.457: R11.1 3.25,5.71 2.03,6.93 U$1.1
N$10  (via drill 0.3)
  Top 0.457: v17.88,7.14 12.8,12.22 12.8,17.09 16.46,20.75 22.15,20.75 22.96,21.57 22.96,27.86 25.4,30.3 36.37,30.3 v39.22,33.15 | v53.65,34.77 51.41,34.77 v51,35.18
  Bottom 0.457: v17.88,7.14 49.38,7.14 54.25,12.01 54.25,16.69 54.05,16.89 53.24,16.89 51.21,18.92 49.17,18.92 48.36,19.74 U2.44 | v39.22,33.15 39.62,33.15 43.08,36.6 43.69,36.6 47.75,32.54 48.36,32.54 48.77,32.94 U2.24 48.97,33.15 v51,35.18 | v53.65,34.77 53.03,34.16 53.03,33.55 C1.2
N$11
  Top 0.457: RL5.2 18.9,48.39 16.66,48.39 LED5.3
N$12
  Bottom 0.457: RL6.2 20.93,39.04 20.93,39.65 12.39,48.18 11.58,48.18 LED5.1
N$13
  Bottom 0.61: 78.13,21.46 77.62,21.97 IC3.16 | 78.13,21.46 81.89,17.7 81.89,8.36 RGB2_D7-8-13.R | 78.13,21.46 78.64,21.97 IC3.15
N$22  (via drill 0.3)
  Top 0.61: v45.11,41.07 60.55,41.07 64.41,37.21 65.84,37.21 74.98,28.07 v75.59,28.07
  Bottom 0.61: v45.11,41.07 45.11,44.93 D9_IO2.PWM | v75.59,28.07 76.81,28.07 77.01,28.27 78.64,28.27 82.5,24.41 82.5,22.17 IC3.12
N$48
  Bottom 0.61: 75.59,21.36 74.98,21.97 IC3.18 | 75.59,21.36 80.67,16.28 80.67,5.71 RGB2_D7-8-13.B | 75.59,21.36 76.2,21.97 IC3.17
N$50
  Bottom 0.61: 62.89,21.46 62.38,21.97 IC4.16 | 62.89,21.46 64.21,20.14 64.21,5.71 RGB1_D5-6-11.B | 62.89,21.46 63.4,21.97 IC4.15
N$51  (via drill 0.3)
  Top 0.61: v28.65,41.07 43.89,41.07 44.91,40.06 46.33,40.06 49.99,36.4 65.43,36.4 75.18,26.65 v81.48,26.65
  Bottom 0.61: v28.65,41.07 28.65,44.93 D10_IO1.PWM | v81.48,26.65 83.72,24.41 83.72,22.17 IC3.11
N$57
  Bottom 0.61: 67.97,21.46 67.46,21.97 IC4.12 | 67.97,21.46 69.49,19.94 73.97,19.94 79.25,14.66 79.25,8.36 RGB2_D7-8-13.G | 67.97,21.46 68.48,21.97 IC4.11
N$60  (via drill 0.3)
  Top 0.61: v61.77,41.07 71.73,41.07 72.54,40.26 72.54,32.33 v77.42,27.46
  Bottom 0.61: v61.77,41.07 61.77,44.93 D2_IO4.PWM | v77.42,27.46 77.42,26.04 79.86,23.6 79.86,22.17 IC3.14
N$68
  Bottom 0.61: 65.02,21.77 64.82,21.97 IC4.14 | 65.02,21.77 65.23,21.57 65.23,8.36 RGB1_D5-6-11.R | IC4.13 66.04,21.97 65.23,21.97 65.02,21.77
N$70
  Bottom 0.457: R5.1 48.56,13.03 48.56,8.56 48.77,8.36 J1.RX
N$71  (via drill 0.3)
  Top 0.457: v30.28,14.86 29.46,14.86 27.43,16.89 23.37,16.89 22.35,15.88 22.35,8.56 26.42,4.5 31.5,4.5 32.31,5.31 32.31,8.15 I2C_INT0.SCL
  Bottom 0.457: v30.28,14.86 31.9,13.23 R6.1
N$75
  Bottom 0.457: RL3.1 19.1,48.18 19.1,43.92 20.32,42.7 LED3.A
N$76
  Top 0.457: RL2.1 20.93,39.04 19.51,39.04 16.05,42.49 14.02,42.49 LED2.A
RD+  (via drill 0.3)
  Top 0.457: v15.85,11.61 14.22,13.23 R12.1
  Bottom 0.457: v15.85,11.61 36.78,11.61 37.8,12.62 37.8,15.27 43.89,21.36 U2.4
RD-  (via drill 0.3)
  Top 0.457: v40.64,16.89 33.33,16.89 28.65,12.22 26.01,12.22 v23.98,10.19 | v19.91,10.19 14.22,15.88 R13.1
  Bottom 0.457: v40.64,16.89 44.5,20.75 U2.3 | v19.91,10.19 v23.98,10.19
RESET  (via drill 0.3)
  Top 0.457: v23.77,27.66 25.4,27.66 v31.29,21.77 32.11,20.96 v34.14,20.96
  Bottom 0.457: v23.77,27.66 23.98,27.86 26.01,27.86 CON1.RESET | v34.14,20.96 34.14,19.33 34.34,19.13 R1.1 | v31.29,21.77 38.61,29.08 40.03,29.08 40.44,28.68 U2.13
RX  (via drill 0.3)
  Top 0.457: v46.53,25.22 46.53,20.75 v49.99,17.3
  Bottom 0.457: v46.53,25.22 45.92,25.83 45.92,27.05 46.33,27.46 46.33,30.71 44.7,32.33 U2.20 | v49.99,17.3 48.56,15.88 R5.2
RXLED  (via drill 0.3)
  Top 0.457: 22.35,47.57 21.74,48.18 RL5.1 22.35,47.37 22.35,45.54 20.73,43.92 7.52,43.92 6.5,42.9 6.5,42.09 7.11,41.48 8.13,41.48 8.94,40.66 8.94,38.02 13.41,33.55 13.41,33.15 21.13,25.43 v21.74,25.43 | v37.39,22.17 34.75,19.53 30.89,19.53 28.04,22.38 v24.79,22.38
  Bottom 0.457: v37.39,22.17 40.23,22.17 41.66,23.6 U2.8 | v21.74,25.43 v24.79,22.38
SCK  (via drill 0.3)
  Top 0.457: v22.96,28.88 25.2,31.12 v32.31,31.12 | v32.31,26.44 32.31,24.61 33.73,23.19 v38,23.19
  Bottom 0.457: v22.96,28.88 22.96,27.46 23.57,26.85 26.01,26.85 CON1.SCK | v32.31,26.44 v32.31,31.12 | v38,23.19 40.03,23.19 41.05,24.21 U2.9
SCL  (via drill 0.3)
  Top 0.457: v30.89,33.96 39.42,33.96 44.09,29.29 v45.52,29.29 45.31,29.08 45.31,27.86 44.09,26.65 44.09,24.21 v39.83,19.94
  Bottom 0.457: v45.52,29.29 43.48,31.32 U2.18 | v30.89,33.96 29.46,32.54 R7.1 | v39.83,19.94 36.98,17.09 33.73,17.09 32.72,16.08 32.11,16.08 R6.2
SDA
  Bottom 0.457: U2.19 43.89,31.93 43.48,32.33 39.22,32.33 26.62,19.74 26.62,19.13 R8.1 26.62,18.92 28.85,16.69 28.85,16.08 R2.2
TX  (via drill 0.3)
  Top 0.457: v47.14,27.66 47.14,26.85 45.72,25.43 45.72,18.72 v44.09,17.09
  Bottom 0.457: v47.14,27.66 47.14,31.12 45.31,32.94 U2.21 | v44.09,17.09 45.31,15.88 R3.2
TXLED  (via drill 0.3)
  Top 0.457: v42.67,35.18 41.86,35.99 v22.55,35.99
  Bottom 0.457: v42.67,35.18 44.09,35.18 45.52,33.76 U2.22 | v22.55,35.99 21.13,35.99 RL6.1
VUSB  (via drill 0.3)
  Top 0.457: v35.56,21.36 34.34,20.14 31.29,20.14 28.25,23.19 24.59,23.19 v23.77,22.38 | 16.87,22.38 16.46,22.38 11.38,17.3 9.14,17.3 7.52,15.67 X2.1 | 16.87,22.38 v21.54,22.38 | v16.87,22.17 16.87,22.38
  Bottom 0.457: 13.41,16.08 C7.2 13.41,16.28 13.41,18.72 v16.87,22.17 17.48,22.78 17.48,23.39 D3.A | v35.56,21.36 40.64,21.36 42.27,22.99 U2.7 | v21.54,22.38 v23.77,22.38

### Text on the board
Bottom: NANO / V2.0